# EAGLE schematic CajitaAbierta (EAGLE 9.6.2)
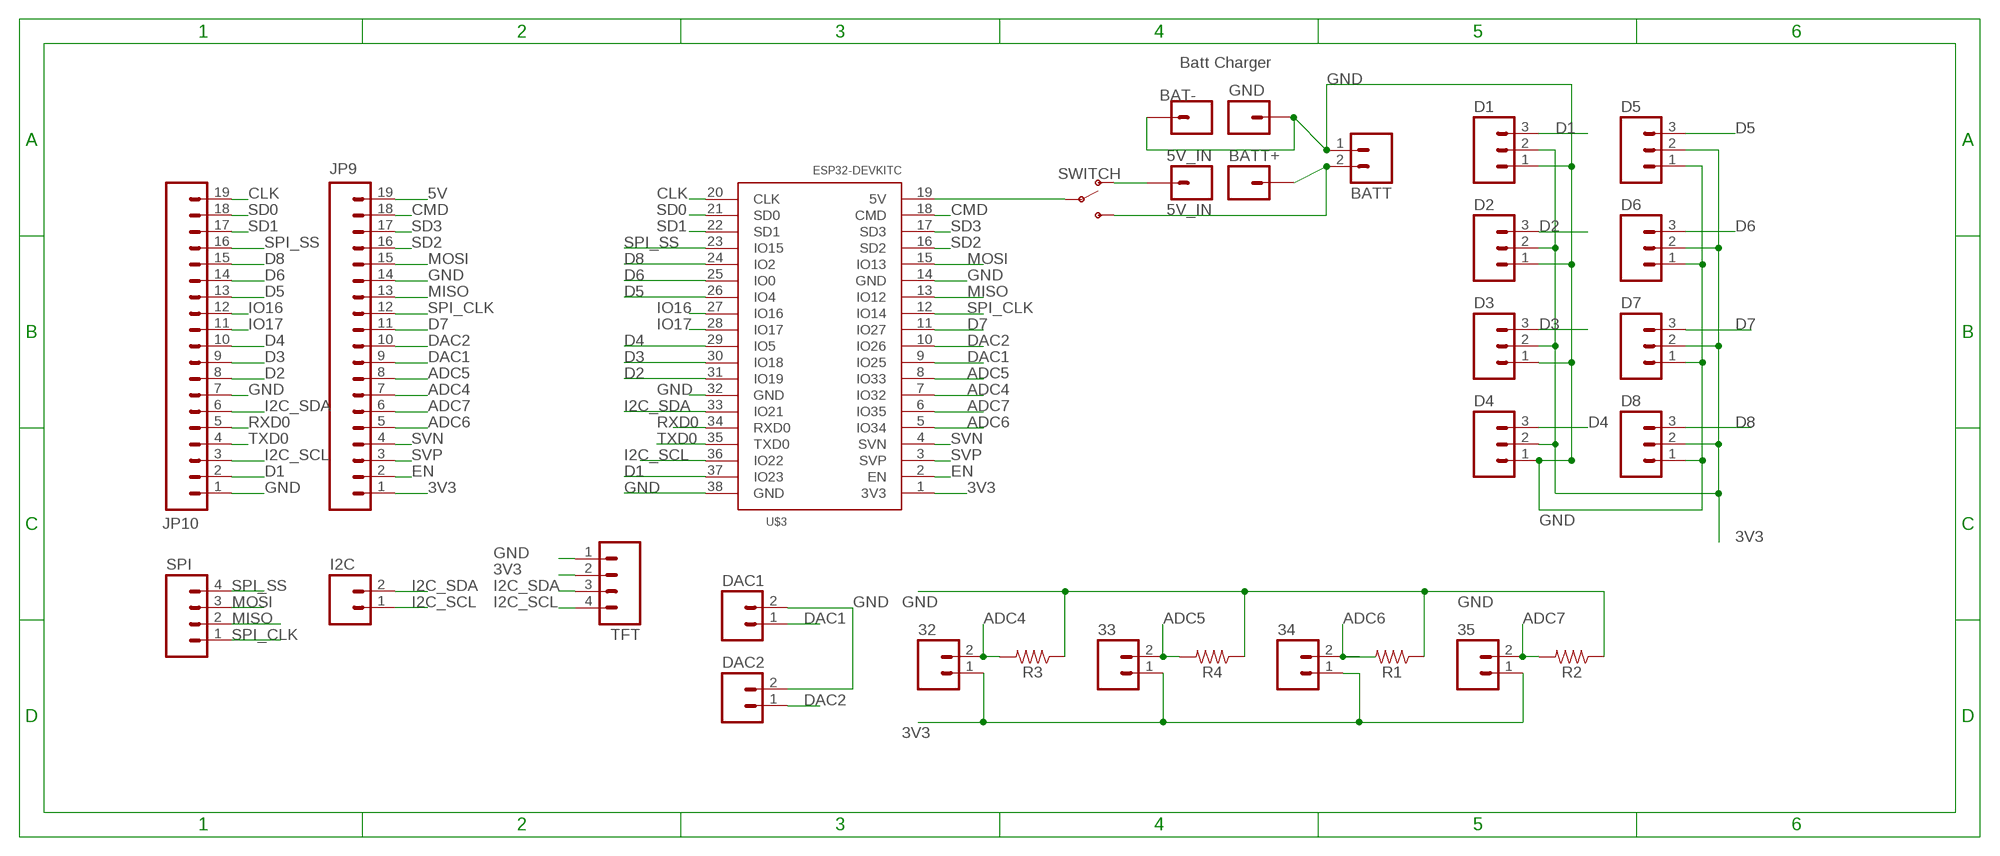
[diagram p0: schematic, sheet 1]

## Parts
5V_IN  5V_IN  M01PTH  [1X01]
32  M02PTH  [1X02]
33  M02PTH  [1X02]
34  M02PTH  [1X02]
35  M02PTH  [1X02]
BAT-  M01PTH  [1X01]
BATT  M02LOCK_LONGPADS  [1X02_LOCK_LONGPADS]
BATT+  M01PTH  [1X01]
D1  M03LOCK_LONGPADS  [1X03_LOCK_LONGPADS]
D2  M03LOCK_LONGPADS  [1X03_LOCK_LONGPADS]
D3  M03LOCK_LONGPADS  [1X03_LOCK_LONGPADS]
D4  M03LOCK_LONGPADS  [1X03_LOCK_LONGPADS]
D5  M03LOCK_LONGPADS  [1X03_LOCK_LONGPADS]
D6  M03LOCK_LONGPADS  [1X03_LOCK_LONGPADS]
D7  M03LOCK_LONGPADS  [1X03_LOCK_LONGPADS]
D8  M03LOCK_LONGPADS  [1X03_LOCK_LONGPADS]
DAC1  M02PTH  [1X02]
DAC2  M02PTH  [1X02]
GND  Batt Charger  M01PTH  [1X01]
I2C  M02PTH  [1X02]
JP9  M191X19  [1X19]
JP10  M191X19  [1X19]
R1  RESISTOR1206  [1206]
R2  RESISTOR1206  [1206]
R3  RESISTOR1206  [1206]
R4  RESISTOR1206  [1206]
SPI  M04PTH  [1X04]
SWITCH  SWITCH-SPDT-SMD-RIGHT-ANGLE  [SWITCH_SPST_SMD_A]
TFT  M04PTH  [1X04]
U$3  ESP32DEVKITC  [ESP32-DEVKITC]

## Nets
3V3: 32.1 33.1 34.1 35.1 D1.2 D2.2 D3.2 D4.2 D5.2 D6.2 D7.2 D8.2 JP9.1 TFT.2 U$3.1(3V3)
5V: JP9.19 SWITCH.2(P) U$3.19(5V)
5V_IN: 5V_IN.1 SWITCH.1(O)
ADC4: 32.2 JP9.7 R3.2 U$3.7(IO32)
ADC5: 33.2 JP9.8 R4.2 U$3.8(IO33)
ADC6: 34.2 JP9.5 R1.2 U$3.5(IO34)
ADC7: 35.2 JP9.6 R2.2 U$3.6(IO35)
BATT+: BATT+.1 BATT.2 SWITCH.3(S)
CLK: JP10.19 U$3.20(CLK)
CMD: JP9.18 U$3.18(CMD)
D1: D1.3 JP10.2 U$3.37(IO23)
D2: D2.3 JP10.8 U$3.31(IO19)
D3: D3.3 JP10.9 U$3.30(IO18)
D4: D4.3 JP10.10 U$3.29(IO5)
D5: D5.3 JP10.13 U$3.26(IO4)
D6: D6.3 JP10.14 U$3.25(IO0)
D7: D7.3 JP9.11 U$3.11(IO27)
D8: D8.3 JP10.15 U$3.24(IO2)
DAC1: DAC1.1 JP9.9 U$3.9(IO25)
DAC2: DAC2.1 JP9.10 U$3.10(IO26)
EN: JP9.2 U$3.2(EN)
GND: BAT-.1 BATT.1 D1.1 D2.1 D3.1 D4.1 D5.1 D6.1 D7.1 D8.1 DAC1.2 DAC2.2 GND.1 JP9.14 JP10.1 JP10.7 R1.1 R2.1 R3.1 R4.1 TFT.1 U$3.14(GND) U$3.32(GND) U$3.38(GND)
I2C_SCL: I2C.1 JP10.3 TFT.4 U$3.36(IO22)
I2C_SDA: I2C.2 JP10.6 TFT.3 U$3.33(IO21)
IO16: JP10.12 U$3.27(IO16)
IO17: JP10.11 U$3.28(IO17)
MISO: JP9.13 SPI.2 U$3.13(IO12)
MOSI: JP9.15 SPI.3 U$3.15(IO13)
RXD0: JP10.5 U$3.34(RXD0)
SD0: JP10.18 U$3.21(SD0)
SD1: JP10.17 U$3.22(SD1)
SD2: JP9.16 U$3.16(SD2)
SD3: JP9.17 U$3.17(SD3)
SPI_CLK: JP9.12 SPI.1 U$3.12(IO14)
SPI_SS: JP10.16 SPI.4 U$3.23(IO15)
SVN: JP9.4 U$3.4(SVN)
SVP: JP9.3 U$3.3(SVP)
TXD0: JP10.4 U$3.35(TXD0)

## Library data of the parts
5V_IN BAT- BATT+ GND = SparkFun-Connectors:M01: Header 1 Standard 1-pin 0.1" header. Use with straight break away headers (SKU : PRT-00116), right angle break away headers (PRT-00553), swiss pins (PRT-00743), machine pins (PRT-00117), and female headers (PRT-00115).
32-35 BATT DAC1 DAC2 I2C = SparkFun-Connectors:M02: Standard 2-pin 0.1" header. Use with - straight break away headers ( PRT-00116) - right angle break away headers (PRT-00553) - swiss pins (PRT-00743) - machine pins (PRT-00117) - female headers (PRT-00115) Molex polarized connector foot print use with: PRT-08233 with associated crimp pins and housings. 2.54_SCREWTERM for use with PRT-10571. 3.5mm Screw Terminal footprints for PRT-08084 5mm Screw Terminal footprints for use with PRT-08432
D1-D8 = SparkFun-Connectors:M03: Header 3 Standard 3-pin 0.1" header. Use with straight break away headers (SKU : PRT-00116), right angle break away headers (PRT-00553), swiss pins (PRT-00743), machine pins (PRT-00117), and female headers (PRT-00115). Molex polarized connector foot print use with SKU : PRT-08232 with associated crimp pins and housings.
JP9 JP10 = SparkFun-Connectors:M19: 1x19 .1" header
R1-R4 = SparkFun-Resistors:RESISTOR: Generic Resistor Package
SPI TFT = SparkFun-Connectors:M04: Header 4 Standard 4-pin 0.1" header. Use with straight break away headers (SKU : PRT-00116), right angle break away headers (PRT-00553), swiss pins (PRT-00743), machine pins (PRT-00117), and female headers (PRT-00115). Molex polarized connector foot print use with SKU : PRT-08231 with associated crimp pins and housings. 1MM SMD Version SKU: PRT-10208
SWITCH = SparkFun-Switches:SWITCH-SPDT: Single Pole, Double Throw (SPDT) Switch Single-pole, double-throw (SPDT) switch. Variant Overview SMD-AYZ0202 Surface Mount DPDT Switch <https://www.sparkfun.com/products/597> (COM-00597) Used on e.g. LilyPad Arduino USB - ATmega32U4 Board <https://www.sparkfun.com/products/12049> PTH-11.6X4.0MM SPDT Mini Power Switch <https://www.sparkfun.com/products/102> (COM-00102) Used on e.g. SparkFun Simon Says - Through-Hole Soldering Kit <https://www.sparkfun.com/products/10547> (KIT-10547) PTH-11.6X4.0MM-KIT KIT version of SPDT Mini Power Switch - Simplifies soldering by removing tStop of switch pins - only one side can be soldered. PTH-11.6X4.0MM-LOCK LOCK version of SPDT Mini Power Switch - Offset pins hold switch in place for easier soldering. SMD-RIGHT-ANGLE Surface Mount Right Angle Switch <https://www.sparkfun.com/products/10860> (COM-10860) Used on e.g. SparkFun ESP8266 Thing <https://www.sparkfun.com/products/13231>; PROD_ID: SWCH-10651; SF_SKU: COM-10860
U$3 = ESP32-DEVKITC:ESP32DEVKITC